# Altium schematic sheet Powers.SchDoc
size A3; SheetNumber: 4; SheetTotal: 6
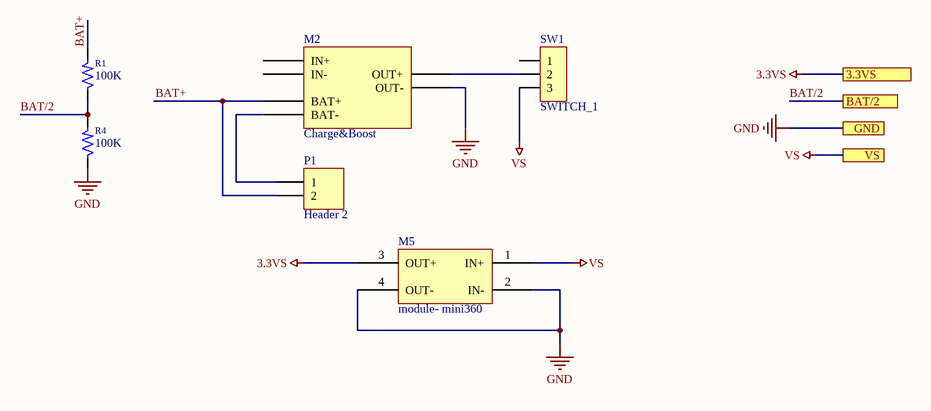
[diagram p0: Powers.SchDoc]

## Parts
M2  Charge&Boost  [Charge&Boost]
M5  module- mini360  [MODULE-MINI360]
P1  Header 2  [HDR1X2]
R1  100K  [RESC2012X70N]
R4  100K  [RESC2012X70N]
SW1  SWITCH_1  [SWITCH]

## Ports
3.3VS, BAT/2, GND, VS

## Nets
3.3VS: M5.3(OUT+) ; port 3.3VS
GND: M2.OUT- M5.2(IN-) M5.4(OUT-) R4.1 ; port GND
VS: M5.1(IN+) SW1.3 ; port VS
BAT+: M2.BAT+ P1.2 R1.2
BAT/2: R1.1 R4.2 ; port BAT/2
NetM2_BAT-: M2.BAT- P1.1
NetM2_OUT+: M2.OUT+ SW1.2

Not connected (* = marked no-connect by the designer): M2 IN+ IN-; SW1 1

## Library data of the parts
P1 = Header 2: Header, 2-Pin; LatestRevisionDate: 17-Jul-2002; LatestRevisionNote: Re-released for DXP Platform.; Publisher: Altium Limited
R1 R4 = Res SMD: Res 0805